# EAGLE design arduino-nano-dcc-v2 (EAGLE 9.6.2)
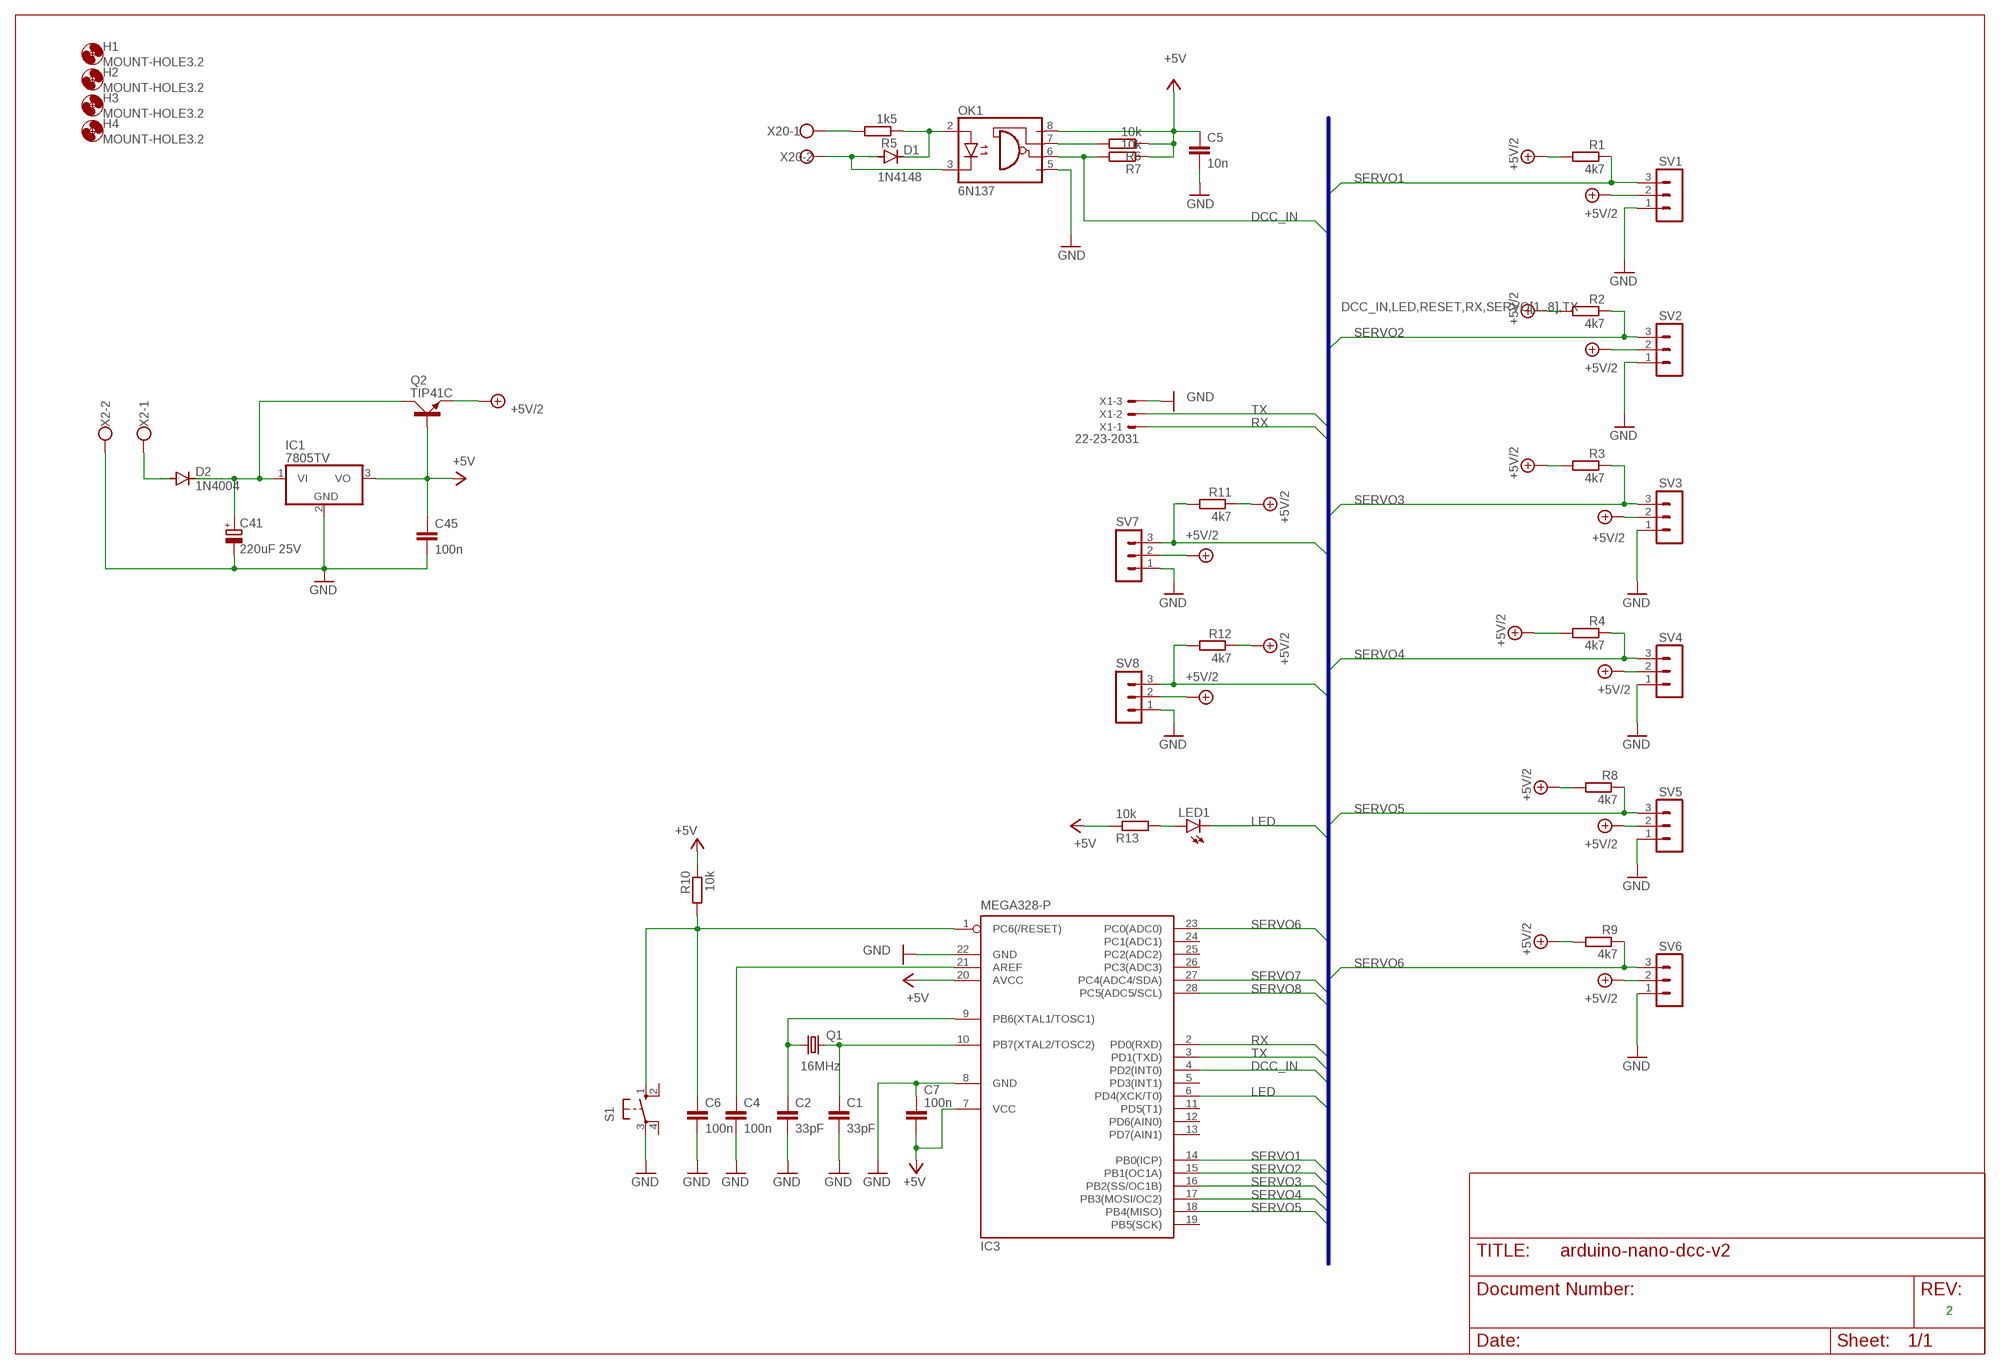
[diagram p0: schematic, sheet 1]

## Parts
C1  33pF  C-EU025-024X044  [C025-024X044]
C2  33pF  C-EU025-024X044  [C025-024X044]
C4  100n  C-EU050-024X044  [C050-024X044]
C5  10n  C-EU050-024X044  [C050-024X044]
C6  100n  C-EU050-024X044  [C050-024X044]
C7  100n  C-EU050-024X044  [C050-024X044]
C41  220uF 25V  CPOL-EUE5-8.5  [E5-8,5]
C45  100n  C-EU050-024X044  [C050-024X044]
D1  1N4148  1N4148DO35-7  [DO35-7]
D2  1N4004  [DO41-10]
H1  MOUNT-HOLE3.2  [3,2]
H2  MOUNT-HOLE3.2  [3,2]
H3  MOUNT-HOLE3.2  [3,2]
H4  MOUNT-HOLE3.2  [3,2]
IC1  7805TV  [TO220V]
IC3  MEGA328-P  MEGA8-P  [DIL28-3]
LED1  LED3MM  [LED3MM]
OK1  6N137  [DIL08]
Q1  16MHz  CRYSTALHC49U-V  [HC49U-V]
Q2  TIP41C  [TO220AV]
R1  4k7  R-EU_0204/7  [0204/7]
R2  4k7  R-EU_0204/7  [0204/7]
R3  4k7  R-EU_0204/7  [0204/7]
R4  4k7  R-EU_0204/7  [0204/7]
R5  1k5  R-EU_0204/7  [0204/7]
R6  10k  R-EU_0204/7  [0204/7]
R7  10k  R-EU_0204/7  [0204/7]
R8  4k7  R-EU_0204/7  [0204/7]
R9  4k7  R-EU_0204/7  [0204/7]
R10  10k  R-EU_0204/7  [0204/7]
R11  4k7  R-EU_0204/7  [0204/7]
R12  4k7  R-EU_0204/5  [0204/5]
R13  10k  R-EU_0204/2V  [0204V]
S1  10-XX  [B3F-10XX]
SV1  MA03-1  [MA03-1]
SV2  MA03-1  [MA03-1]
SV3  MA03-1  [MA03-1]
SV4  MA03-1  [MA03-1]
SV5  MA03-1  [MA03-1]
SV6  MA03-1  [MA03-1]
SV7  MA03-1  [MA03-1]
SV8  MA03-1  [MA03-1]
X1  22-23-2031  [22-23-2031]
X2  W237-102  [W237-102]
X20  W237-102  [W237-102]

## Nets
+5V: C5.1 C7.2 C45.1 IC1.3(VO) IC3.7(VCC) IC3.20(AVCC) OK1.8(VCC) Q2.B R6.1 R7.1 R10.1 R13.1
+5V/2: Q2.E R1.2 R2.2 R3.2 R4.2 R8.2 R9.2 R11.1 R12.1 SV1.2 SV2.2 SV3.2 SV4.2 SV5.2 SV6.2 SV7.2 SV8.2
DCC_IN: IC3.4(PD2(INT0)) OK1.6(VO) R7.2
GND: C1.2 C2.2 C4.2 C5.2 C6.2 C7.1 C41.- C45.2 IC1.2(GND) IC3.8(GND) IC3.22(GND) OK1.5(GND) S1.3(P) SV1.1 SV2.1 SV3.1 SV4.1 SV5.1 SV6.1 SV7.1 SV8.1 X1.3 X2.2
LED: IC3.6(PD4(XCK/T0)) LED1.K(C)
N$1: C41.+ D2.C IC1.1(VI) Q2.C
N$2: D2.A X2.1
N$3: C2.1 IC3.9(PB6(XTAL1/TOSC1)) Q1.1
N$4: C1.1 IC3.10(PB7(XTAL2/TOSC2)) Q1.2
N$5: C6.1 IC3.1(PC6(/RESET)) R10.2 S1.1(S)
N$6: C4.1 IC3.21(AREF)
N$7: LED1.A R13.2
N$17: D1.C OK1.2(A) R5.1
N$18: OK1.7(VE) R6.2
N$19: D1.A OK1.3(C) X20.2
N$20: R5.2 X20.1
RX: IC3.2(PD0(RXD)) X1.1
SERVO1: IC3.14(PB0(ICP)) R1.1 SV1.3
SERVO2: IC3.15(PB1(OC1A)) R2.1 SV2.3
SERVO3: IC3.16(PB2(SS/OC1B)) R3.1 SV3.3
SERVO4: IC3.17(PB3(MOSI/OC2)) R4.1 SV4.3
SERVO5: IC3.18(PB4(MISO)) R8.1 SV5.3
SERVO6: IC3.23(PC0(ADC0)) R9.1 SV6.3
SERVO7: IC3.27(PC4(ADC4/SDA)) R11.2 SV7.3
SERVO8: IC3.28(PC5(ADC5/SCL)) R12.2 SV8.3
TX: IC3.3(PD1(TXD)) X1.2
Unconnected: IC3.5(PD3(INT1)) IC3.11(PD5(T1)) IC3.12(PD6(AIN0)) IC3.13(PD7(AIN1)) IC3.19(PB5(SCK)) IC3.24(PC1(ADC1)) IC3.25(PC2(ADC2)) IC3.26(PC3(ADC3)) S1.2(S1) S1.4(P1)

## Buses
DCC_IN,LED,RESET,RX,SERVO[1..8],TX

## Notes on the sheet
- 2

## Library data of the parts
C1 C2 C4 C6 C7 = rcl:C-EU: CAPACITOR, European symbol; SPICEPREFIX: C
C5 C45 = rcl:C-EU: CAPACITOR, European symbol
C41 = rcl:CPOL-EU: POLARIZED CAPACITOR, European symbol
D1 = diode:1N4148: DIODE high speed (Philips)
D2 = diode:1N4004: DIODE general purpose rectifier, 1 A
H1-H4 = holes:MOUNT-HOLE: MOUNTING HOLE with drill center marker
IC1 = linear:78*: Positive VOLTAGE REGULATOR Source: http://cache.national.com/ds/LM/LM78L05.pdf http://www.fairchildsemi.com/ds/LM/LM7805.pdf
IC3 = atmel:MEGA8-P: MICROCONTROLLER 8 Kbytes FLASH, 1 kbytes SRAM, 512 bytes EEPROM, USART, 4-channel 10 bit ADC, 2-channel 8 bit ADC Pin compatible with Atmega48, ATMega88, ATMega168 Source: avr.lbr; OC_FARNELL: unknown; OC_NEWARK: unknown
LED1 = led:LED: LED OSRAM: - CHIPLED LG R971, LG N971, LY N971, LG Q971, LY Q971, LO R971, LY R971 LH N974, LH R974 LS Q976, LO Q976, LY Q976 LO Q996 - Hyper CHIPLED LW Q18S LB Q993, LB Q99A, LB R99A - SideLED LS A670, LO A670, LY A670, LG A670, LP A670 LB A673, LV A673, LT A673, LW A673 LH A674 LY A675 LS A676, LA A676, LO A676, LY A676, LW A676 LS A679, LY A679, LG A679 - Hyper Micro SIDELED® LS Y876, LA Y876, LO Y876, LY Y876 LT Y87S - SmartLED LW L88C, LW L88S LB L89C, LB L89S, LG L890 LS L89K, LO L89K, LY L89K LS L896, LA L896, LO L896, LY L896 - TOPLED LS T670, LO T670, LY T670, LG T670, LP T670 LSG T670, LSP T670, LSY T670, LOP T670, LYG T670 LG T671, LOG T671, LSG T671 LB T673, LV T673, LT T673, LW T673 LH T674 LS T676, LA T676, LO T676, LY T676, LB T676, LH T676, LSB T676, LW T676 LB T67C, LV T67C, LT T67C, LS T67K, LO T67K, LY T67K, LW E67C LS E67B, LA E67B, LO E67B, LY E67B, LB E67C, LV E67C, LT E67C LW T67C LS T679, LY T679, LG T679 LS T770, LO T770, LY T770, LG T770, LP T770 LB T773, LV T773, LT T773, LW T773 LH T774 LS E675, LA E675, LY E675, LS T675 LS T776, LA T776, LO T776, LY T776, LB T776 LHGB T686 LT T68C, LB T68C - Hyper Mini TOPLED® LB M676 - Mini TOPLED Santana® LG M470 LS M47K, LO M47K, LY M47K Source: http://www.osram.convergy.de LUXEON: - LUMILED® LXK2-PW12-R00, LXK2-PW12-S00, LXK2-PW14-U00, LXK2-PW14-V00 LXK2-PM12-R00, LXK2-PM12-S00, LXK2-PM14-U00 LXK2-PE12-Q00, LXK2-PE12-R00, LXK2-PE12-S00, LXK2-PE14-T00, LXK2-PE14-U00 LXK2-PB12-K00, LXK2-PB12-L00, LXK2-PB12-M00, LXK2-PB14-N00, LXK2-PB14-P00, LXK2-PB14-Q00 LXK2-PR12-L00, LXK2-PR12-M00, LXK2-PR14-Q00, LXK2-PR14-R00 LXK2-PD12-Q00, LXK2-PD12-R00, LXK2-PD12-S00 LXK2-PH12-R00, LXK2-PH12-S00 LXK2-PL12-P00, LXK2-PL12-Q00, LXK2-PL12-R00 Source: www.luxeon.com KINGBRIGHT: KA-3528ASYC Source: www.kingbright.com
OK1 = optocoupler:6N137: MOTOROLA OPTO COUPLER; MPN: 6N137; OC_FARNELL: 1328376; OC_NEWARK: 52M1895
Q1 = crystal:CRYSTAL: CRYSTAL; OC_FARNELL: 1666969; OC_NEWARK: unknown
Q2 = transistor-power:TIP41C: NPN TRANSISTOR
R1-R13 = rcl:R-EU_: RESISTOR, European symbol
S1 = switch-omron:10-XX: OMRON SWITCH; MPN: B3F-1000; OC_FARNELL: 176432; OC_NEWARK: 36M3542
SV1-SV8 = con-lstb:MA03-1: PIN HEADER; OC_FARNELL: unknown; OC_NEWARK: unknown
X1 = con-molex:22-23-2031: .100" (2.54mm) Center Header - 3 Pin; MF: MOLEX; MPN: 22-23-2031; OC_FARNELL: 1462950; OC_NEWARK: 30C0862
X2 X20 = con-wago-500:W237-102: WAGO SCREW CLAMP; MPN: 237-102; OC_FARNELL: unknown; OC_NEWARK: 70K9898

## Board
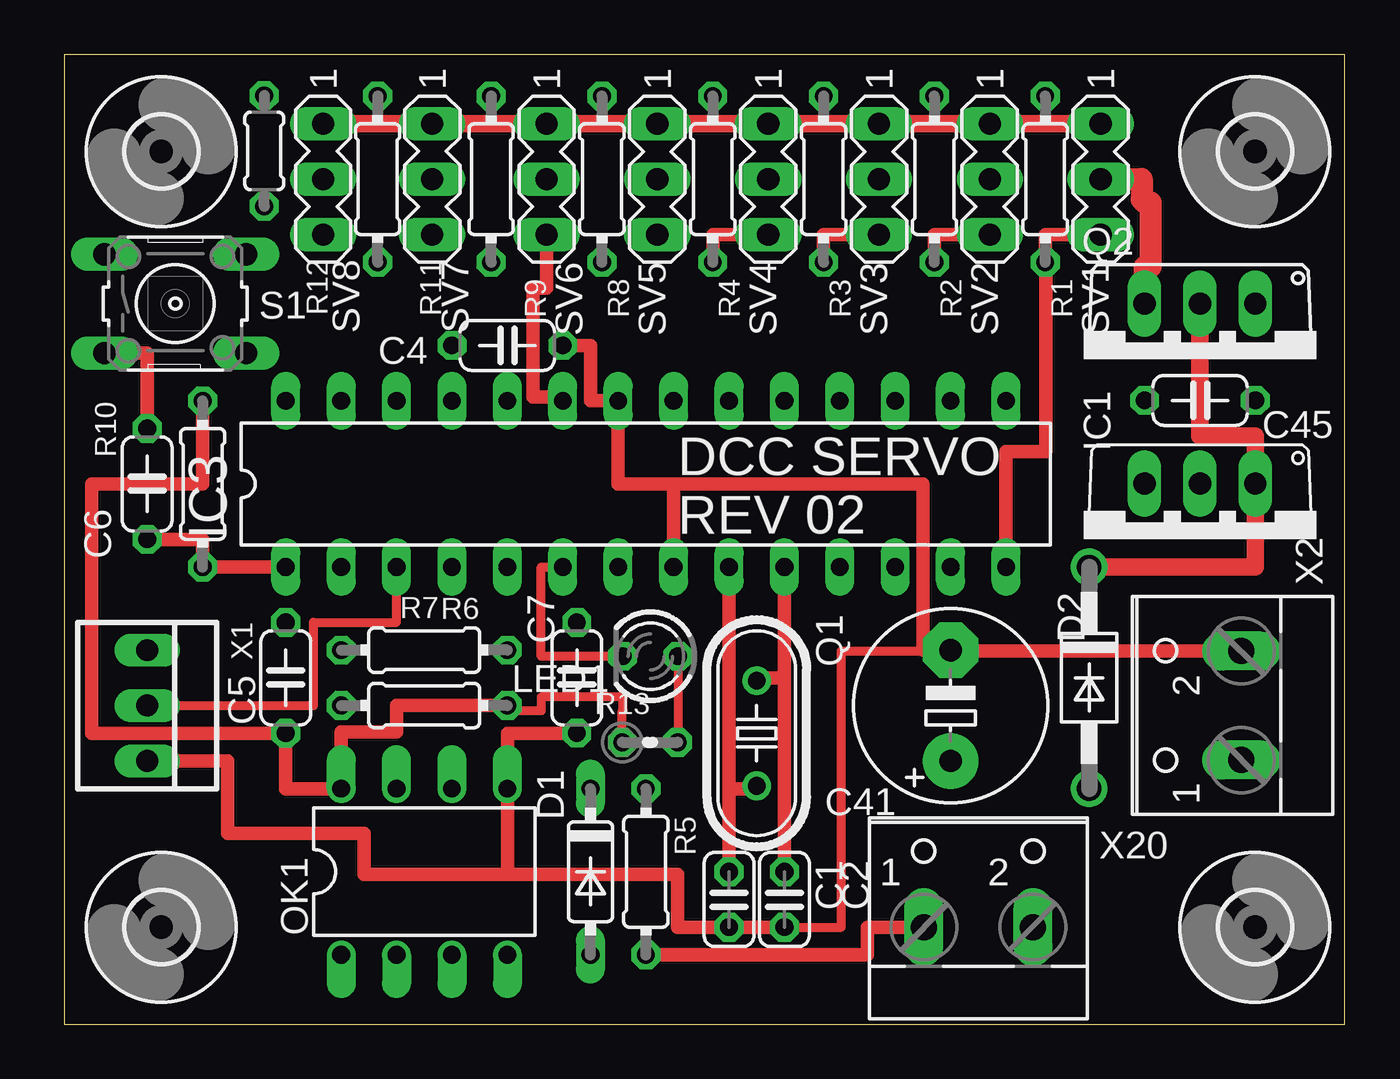
[diagram p1: board, top side]
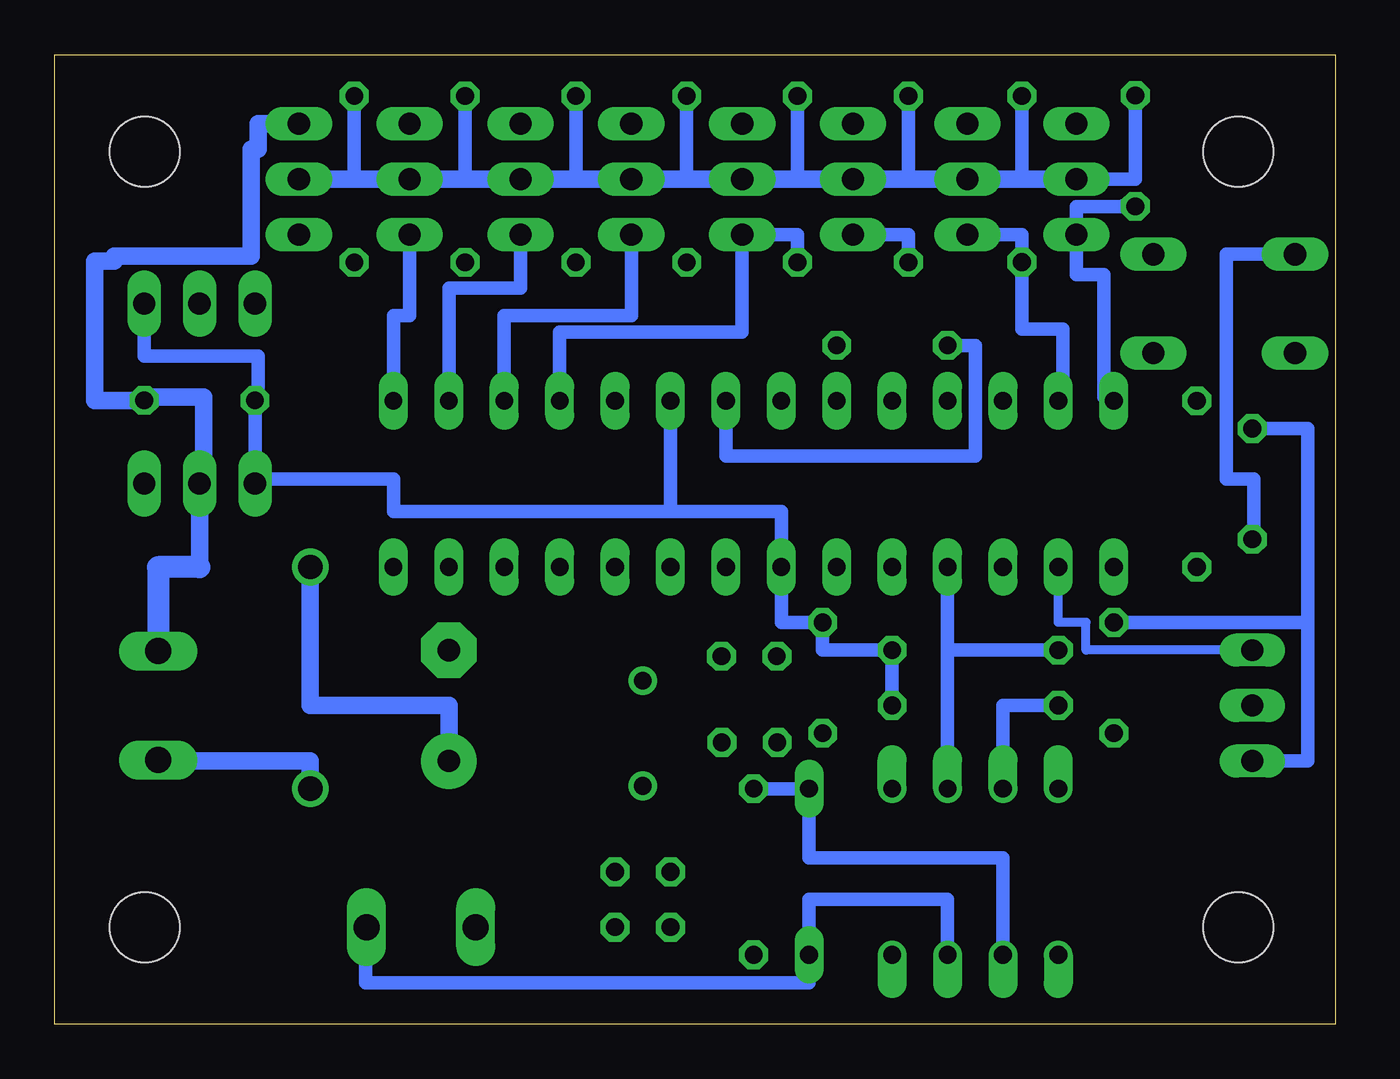
[diagram p2: board, bottom side, seen from below]

Size 58.72 x 44.46 mm. Coordinates in mm from the lower left corner, seen from the top.
Outline: 0,0 58.72,0 58.72,44.46 0,44.46 0,0
Copper layers (1*16): Top 0.035mm / dielectric 1.5mm / Bottom 0.035mm
Design rules "SeeedStudio_2layer_DRU_no_angle_20140221": minimum track width 6mil, minimum drill 12mil, track to track 6mil, track to pad 6mil, pad to pad 6mil, via to via 6mil, smd to smd 0mil, copper to edge 10mil, drill to drill 10mil, minimum pad ring 10mil, minimum via ring 6mil, stop-mask expansion 2mil, vias tented up to drill 100mil, thermal gap 10mil

### Footprints (pad centres in the part's own frame; a part is rotated, then mirrored left to right if it is on the bottom)
C025-024X044 = drill 0.813 octagon: 1 -1.27,0; 2 1.27,0
C050-024X044 = drill 0.813 octagon: 1 -2.54,0; 2 2.54,0
E5-8,5 = drill 1.016 pad 2.54: + -2.54,0 | drill 1.016 pad 2.54 octagon: - 2.54,0
DO35-7 = drill 0.813 long: A 3.81,0; C -3.81,0
DO41-10 = drill 1.118: A 5.08,0; C -5.08,0
3,2 = hole 3.2: 0,0
TO220V = drill 1.016 long: 1 -2.54,-2.54; 2 0,-2.54; 3 2.54,-2.54
DIL28-3 = drill 0.813 long: 1 -16.51,-3.81; 2 -13.97,-3.81; 3 -11.43,-3.81; 4 -8.89,-3.81; 5 -6.35,-3.81; 6 -3.81,-3.81; 7 -1.27,-3.81; 8 1.27,-3.81; 9 3.81,-3.81; 10 6.35,-3.81; 11 8.89,-3.81; 12 11.43,-3.81; 13 13.97,-3.81; 14 16.51,-3.81; 15 16.51,3.81; 16 13.97,3.81; 17 11.43,3.81; 18 8.89,3.81; 19 6.35,3.81; 20 3.81,3.81; 21 1.27,3.81; 22 -1.27,3.81; 23 -3.81,3.81; 24 -6.35,3.81; 25 -8.89,3.81; 26 -11.43,3.81; 27 -13.97,3.81; 28 -16.51,3.81
LED3MM = drill 0.813 octagon: A -1.27,0; K 1.27,0
DIL08 = drill 0.813 offset: 1 -3.81,-3.81; 2 -1.27,-3.81; 3 1.27,-3.81; 4 3.81,-3.81; 5 3.81,3.81; 6 1.27,3.81; 7 -1.27,3.81; 8 -3.81,3.81
HC49U-V = drill 0.813: 1 -2.413,0; 2 2.413,0
TO220AV = drill 1.016 long: B -2.54,-2.54; C 0,-2.54; E 2.54,-2.54
0204/7 = drill 0.813 octagon: 1 -3.81,0; 2 3.81,0
0204/5 = drill 0.813 octagon: 1 -2.54,0; 2 2.54,0
0204V = drill 0.813 octagon: 1 -1.27,0; 2 1.27,0
B3F-10XX = drill 1.016 long: 1 -3.251,2.261; 2 3.251,2.261; 3 -3.251,-2.261; 4 3.251,-2.261
MA03-1 = drill 1.016 long: 1 -2.54,0; 2 0,0; 3 2.54,0
22-23-2031 = drill 1 long: 1 -2.54,0; 2 0,0; 3 2.54,0
W237-102 = drill 1.194 long: 1 -2.5,-1.27; 2 2.5,-1.27

### Placement (x,y rotation side)
C1  33.02,5.72 270 top
C2  30.48,5.72 270 top
C4  20.32,31.12 0 top
C5  10.16,15.88 90 top
C6  3.81,24.77 90 top
C7  23.5,15.88 90 top
C41  40.64,14.62 90 top
C45  52.07,28.61 0 top
D1  24.13,7 270 top
D2  46.99,15.88 270 top
H1  4.46,40.02 0 top
H2  54.59,40.02 0 top
H3  54.59,4.46 0 top
H4  4.46,4.46 0 top
IC1  52.07,22.25 180 top
IC3  26.67,24.77 0 top
LED1  26.88,16.88 180 top
OK1  16.51,7 0 top
Q1  31.75,13.35 90 top
Q2  52.07,30.5 180 top
R1  44.98,38.74 90 top
R2  39.9,38.74 90 top
R3  34.81,38.74 90 top
R4  29.73,38.74 90 top
R5  26.67,7 270 top
R6  16.51,14.62 180 top
R7  16.51,17.16 180 top
R8  24.66,38.74 90 top
R9  19.57,38.74 90 top
R10  6.35,24.77 270 top
R11  14.38,38.75 270 top
R12  9.18,40.04 270 top
R13  26.86,12.93 0 top
S1  5.1,33.04 0 top
SV1  47.52,38.74 270 top
SV2  42.44,38.74 270 top
SV3  37.35,38.74 270 top
SV4  32.27,38.74 270 top
SV5  27.2,38.74 270 top
SV6  22.11,38.74 270 top
SV7  16.88,38.75 270 top
SV8  11.88,38.75 270 top
X1  3.81,14.62 270 top
X2  52.7,14.62 90 top
X20  41.91,5.72 0 top

### Tracks (layer width: path | path; a pad name or v marks a point on that pad's centre or on a via)
+5V
  Top 0.406: R13.1 25.59,14.38 25.62,14.38 25.62,15 21.88,15 21.88,14.38 20.32,14.38 R6.1
  Top 0.61: R6.1 15.24,14.62 15.24,13.4 12.7,13.4 OK1.8 10.16,10.8 C5.1 1.27,13.35 1.27,24.77 6.35,24.77 R10.1
  Bottom 0.61: R6.1 R7.1 23.5,17.16 C7.2 25.4,18.43 IC3.7 25.4,23.5 30.48,23.5 | 30.48,23.5 IC3.20 | 30.48,23.5 43.18,23.5 43.18,25 49.53,25 IC1.3 C45.1 49.38,28.61 49.38,30.62 54.61,30.62 Q2.B
+5V/2
  Top 1.016: SV1.2 49.39,38.75 49.39,37.81 49.53,37.68 49.8,37.68 49.8,34.73 49.53,34.73 Q2.E
  Bottom 0.61: R9.2 19.57,38.74 SV6.2 | SV5.2 24.66,38.74 R8.2 | R4.2 29.73,38.74 SV4.2 | SV3.2 34.81,38.74 R3.2 | SV2.2 39.9,38.74 R2.2 | SV1.2 44.98,38.74 R1.2 | SV7.2 14.38,38.75 R11.1 | R12.1 9.18,38.75 SV8.2
  Bottom 0.813: SV1.2 SV2.2 SV3.2 SV4.2 SV5.2 SV6.2 SV7.2 SV8.2
DCC_IN
  Bottom 0.61: R7.2 17.78,17.16 | 17.78,17.16 IC3.4 | OK1.6 17.78,17.16
GND
  Top 0.406: C1.2 35.62,4.46 35.62,17.11 40.64,17.11
  Top 0.61: C1.2 C2.2 28.12,4.46 28.12,6.88 20.32,6.88 | C7.1 20.32,13.35 OK1.5 20.32,6.88 | 27.94,24.77 25.4,24.77 IC3.22 24.13,28.59 24.13,31.12 C4.2 | 27.94,24.77 IC3.8 | 27.94,24.77 39.38,24.77 39.38,17.16 C41.- 40.64,17.11 X2.2 | C6.2 3.81,30.78 S1.3 | 20.32,6.88 13.75,6.88 13.75,8.75 7.5,8.75 7.5,12.07 X1.3
  Top 0.813: SV1.1 SV2.1 SV3.1 SV4.1 SV5.1 SV6.1 18.3,41.28 18.3,41.29 SV7.1 SV8.1
  Bottom 0.61: C5.2 1.27,18.43 | 1.27,18.43 1.27,12.07 X1.3 | 1.27,18.43 1.27,27.32 C6.2
  Bottom 0.813: 52.07,20.96 IC1.2 51.88,24.8 51.88,28.75 54.61,28.75 C45.2 56.88,28.61 56.88,35 55.98,35 55.98,35.22 49.7,35.22 49.7,40.12 49.38,40.12 49.38,41.28 SV1.1
  Bottom 1.016: 52.07,20.96 53.97,20.96 X2.2
LED
  Top 0.406: LED1.K 21.88,16.88 21.88,20.96 IC3.6
N$1
  Top 0.813: D2.C 54.61,20.96 IC1.1 54.61,26.98 52.07,26.98 Q2.C
  Bottom 0.813: C41.+ 40.64,14.62 46.99,14.62 D2.C
N$2
  Bottom 0.813: X2.1 53.97,12.07 46.99,12.07 D2.A
N$3
  Top 0.61: IC3.9 30.48,10.8 | 30.48,10.8 31.75,10.8 Q1.1 | C2.1 30.48,10.8
N$4
  Top 0.61: Q1.2 31.75,15.88 33.02,15.88 | 33.02,15.88 IC3.10 | C1.1 33.02,15.88
N$5
  Top 0.61: IC3.1 R10.2 6.35,22.23 C6.1
  Bottom 0.61: C6.1 3.75,22.23 3.75,25 5,25 5,35.3 S1.1
N$6
  Bottom 0.61: C4.1 16.51,31.12 16.51,26.05 27.94,26.05 IC3.21
N$7
  Top 0.406: LED1.A 28.14,12.93 R13.2
N$17
  Bottom 0.61: OK1.2 15.24,7.64 24.13,7.64 D1.C R5.1
N$18
  Bottom 0.61: R6.2 15.24,14.62 OK1.7
N$19
  Bottom 0.61: OK1.3 17.78,5.72 24.13,5.72 D1.A 24.13,1.92 44.45,1.92 44.45,4.46 X20.2
N$20
  Top 0.61: R5.2 36.83,3.19 36.83,4.46 X20.1
RX
  Bottom 0.406: X1.1 11.43,17.16 11.43,18.43 12.7,18.43 IC3.2
SERVO1
  Top 0.61: IC3.14 43.18,26.25 45,26.25 45,34.94 R1.1 44.98,36.2 SV1.3
SERVO2
  Top 0.61: R2.1 39.9,36.2 SV2.3
  Bottom 0.61: IC3.15 43.18,32.5 42.44,32.5 SV2.3
SERVO3
  Top 0.61: R3.1 34.81,36.2 SV3.3
  Bottom 0.61: IC3.16 40.64,33.75 37.35,33.75 SV3.3
SERVO4
  Top 0.61: R4.1 29.73,36.2 SV4.3
  Bottom 0.61: IC3.17 38.1,32.5 32.27,32.5 SV4.3
SERVO5
  Bottom 0.61: R8.1 24.66,36.2 SV5.3 27.2,31.74 35.56,31.74 IC3.18
SERVO6
  Top 0.61: IC3.23 22.86,28.75 21.49,28.75 21.49,33.75 22.11,33.75 SV6.3
  Bottom 0.61: R9.1 19.57,36.2 SV6.3
SERVO7
  Bottom 0.61: IC3.27 12.5,28.59 12.5,31.88 14.38,31.88 R11.2 14.38,36.21 SV7.3
SERVO8
  Bottom 0.61: IC3.28 10.16,28.75 10.62,28.75 10.62,34.38 11.88,34.38 SV8.3 11.88,37.48 9.79,37.48 9.79,37.5 R12.2
TX
  Top 0.406: X1.2 11.43,14.62 11.43,18.43 15.24,18.43 IC3.3

### Text on the board
tNames: DCC SERVO / REV 02